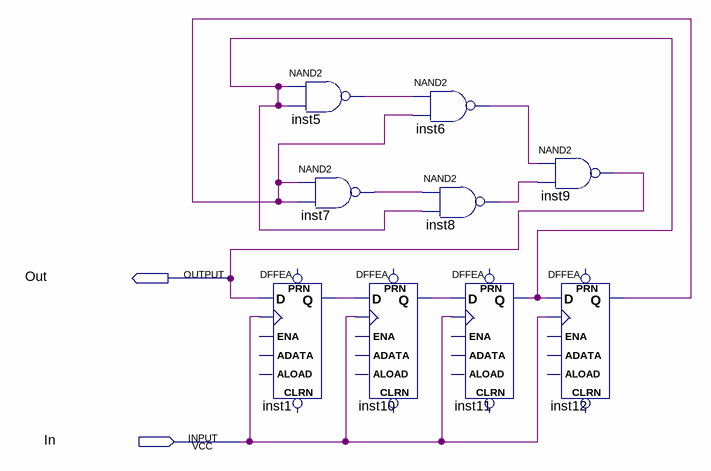
[diagram p0: schematic sheet]
// Quartus schematic MGenerator.bdf as structural Verilog: 9 symbols, 2 pins
module MGenerator (
  input  In,
  output Out
);

  wire inst1_q, inst5_out, inst6_out, inst7_out, inst8_out, inst10_q, inst11_q, inst12_q;

  DFFEA inst1 (.CLK(In), .D(Out), .Q(inst1_q));  // open: PRN, ALOAD, ADATA, ENA, CLRN
  nand inst5 (inst5_out, inst11_q, inst11_q);
  nand inst7 (inst7_out, inst12_q, inst12_q);
  nand inst6 (inst6_out, inst5_out, inst12_q);
  DFFEA inst10 (.CLK(In), .D(inst1_q), .Q(inst10_q));  // open: PRN, ALOAD, ADATA, ENA, CLRN
  nand inst8 (inst8_out, inst7_out, inst11_q);
  DFFEA inst11 (.CLK(In), .D(inst10_q), .Q(inst11_q));  // open: PRN, ALOAD, ADATA, ENA, CLRN
  nand inst9 (Out, inst6_out, inst8_out);
  DFFEA inst12 (.CLK(In), .D(inst11_q), .Q(inst12_q));  // open: PRN, ALOAD, ADATA, ENA, CLRN
endmodule
